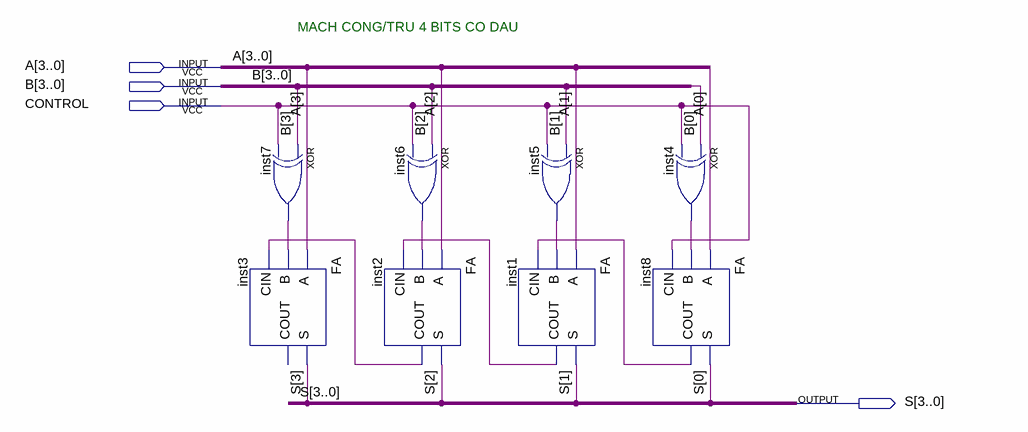
[diagram p0: schematic sheet]
// Quartus schematic CONGTRU4BIT.bdf as structural Verilog: 8 symbols, 4 pins
module CONGTRU4BIT (
  input  [3:0] A,
  input  [3:0] B,
  input  CONTROL,
  output [3:0] S
);

  wire inst1_cout, inst2_cout, inst4_out, inst5_out, inst6_out, inst7_out, inst8_cout;

  xor inst7 (inst7_out, B[3], CONTROL);
  FA inst3 (.A(A[3]), .B(inst7_out), .CIN(inst2_cout), .S(S[3]));  // open: COUT
  FA inst2 (.A(A[2]), .B(inst6_out), .CIN(inst1_cout), .S(S[2]), .COUT(inst2_cout));
  xor inst6 (inst6_out, B[2], CONTROL);
  FA inst1 (.A(A[1]), .B(inst5_out), .CIN(inst8_cout), .S(S[1]), .COUT(inst1_cout));
  xor inst5 (inst5_out, B[1], CONTROL);
  xor inst4 (inst4_out, B[0], CONTROL);
  FA inst8 (.A(A[0]), .B(inst4_out), .CIN(CONTROL), .S(S[0]), .COUT(inst8_cout));

  // Notes on the sheet:
  //   MACH CONG/TRU 4 BITS CO DAU
endmodule
